# Altium schematic sheet MCU.schdoc
size 308 x 181 mm
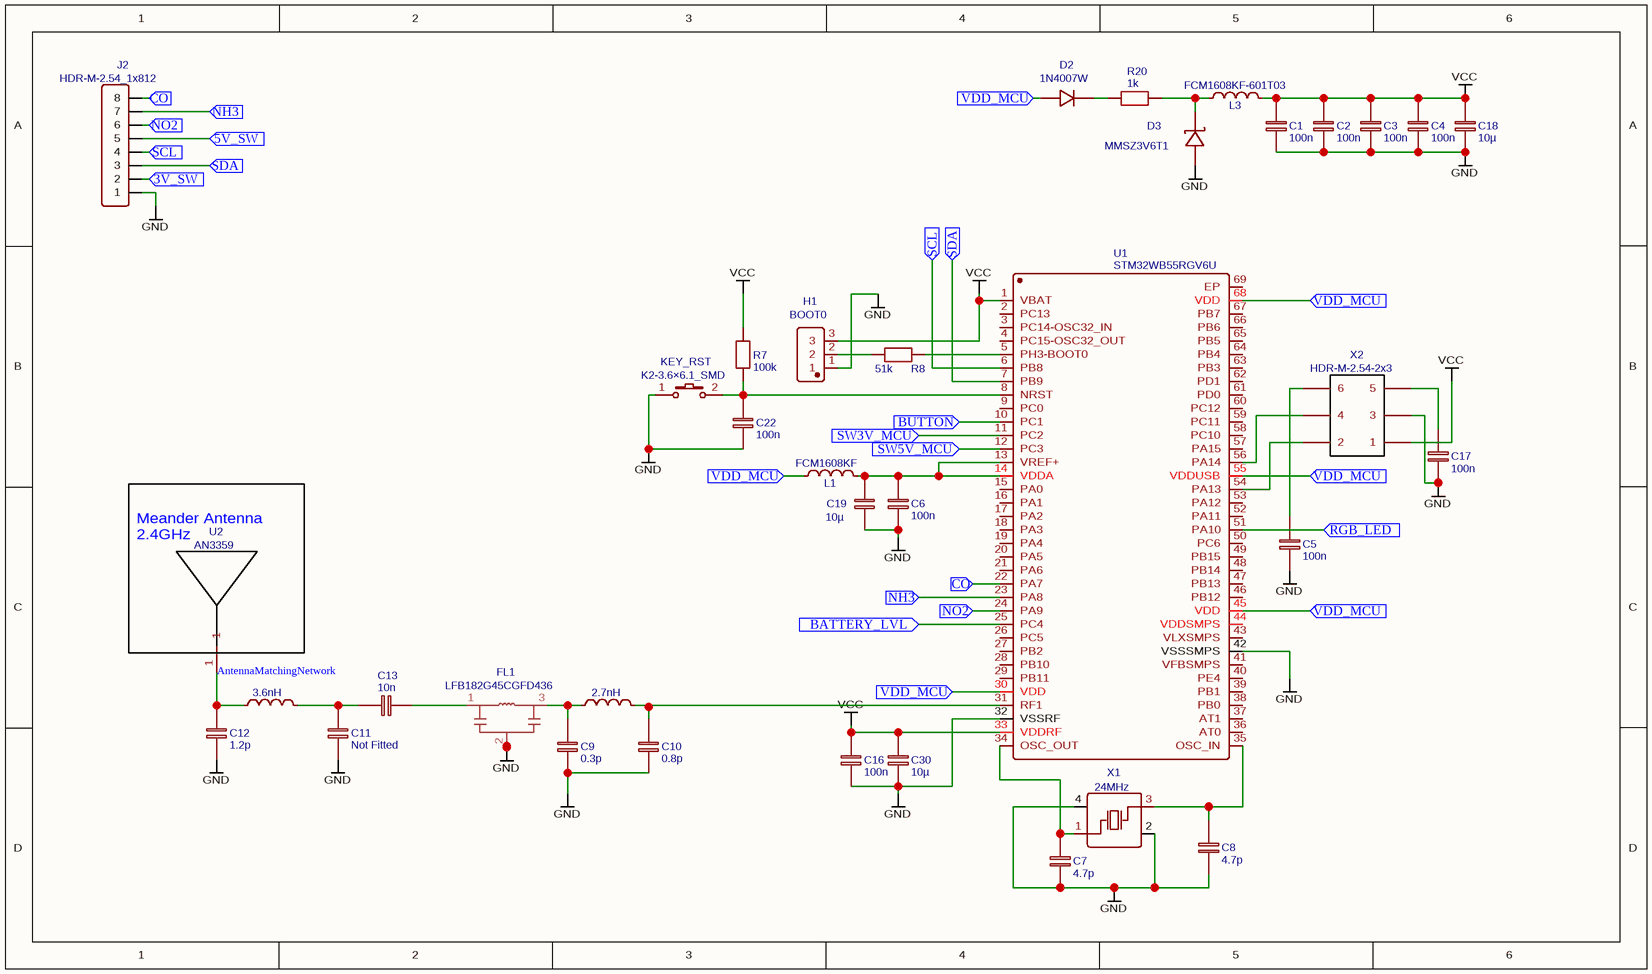
[diagram p0: MCU.schdoc]

## Parts
C1  100n  [C0603]
C2  100n  [C0603]
C3  100n  [C0603]
C4  100n  [C0603]
C5  100n  [C0603]
C6  100n  [C0603]
C7  4.7p  [C0603]
C8  4.7p  [C0603]
C9  0.3p  [C0603]
C10  0.8p  [C0603]
C11  Not Fitted  [C0603]
C12  1.2p  [C0603]
C13  10n  [C0603]
C16  100n  [C0603]
C17  100n  [C0603]
C18  10µ  [C0603]
C19  10µ  [C0603]
C22  100n  [C0603]
C30  10µ  [C0603]
D2  1N4007W  [SOD-123_L2.8-W1.8-LS3.7-RD]
D3  MMSZ3V6T1  [SOD-523_L1.2-W0.8-LS1.6-RD]
FL1  LFB182G45CGFD436  [FIL_LFB182G45CGFD436]
H1  BOOT0  [HDR-TH_03P-P2.54-V-M]
J2  HDR-M-2.54_1x812  [HDR-M-2.54_1X8]
KEY_RST  K2-3.6×6.1_SMD  [KEY-SMD_2P-L6.2-W3.6-LS8.0]
L  3.6nH  [L0402]
L1  FCM1608KF  [L0603]
L3  FCM1608KF-601T03  [L0603]
NO  2.7nH  [L0402]
R7  100k  [R0603]
R8  51k  [R0603]
R20  1k  [R0603]
U1  STM32WB55RGV6U  [VFQFPN-68_L8.0-W8.0-P0.40-TL-EP6.4]
U2  AN3359  [AN3359]
X1  24MHz  [CRYSTAL-SMD_4P-L3.2-W2.5-BL]
X2  HDR-M-2.54-2x3  [HDR-M-2.54-2X3-FP]

## Ports
3V_SW (in), 5V_SW (in), BATTERY_LVL (in), BUTTON (in), CO (in), NH3 (in), NO2 (in), RGB_LED (in), SCL (in), SDA (in), SW3V_MCU (in), SW5V_MCU (in), VDD_MCU (in)

## Nets
GND: C1.1 C2.1 C3.1 C4.1 C5.1 C6.1 C7.1 C8.1 C9.1 C10.1 C11.1 C12.1 C16.1 C17.1 C18.1 C19.1 C22.1 C30.1 D3.2(A) FL1.2(GND) FL1.2_1(GND) H1.1 J2.1 KEY_RST.1 U1.32(VSSRF) U1.42(VSSSMPS) X1.2(GND) X1.4(GND) X2.3
VCC: C1.2 C2.2 C3.2 C4.2 C16.2 C18.2 C30.2 H1.3 L3.2 R7.1 U1.1(VBAT) U1.33(VDDRF) X2.1
3V_SW: J2.2 ; port 3V_SW
5V_SW: J2.5 ; port 5V_SW
AntennaMatchingNetwork: C12.2 L.1 U2.1
BATTERY_LVL: U1.25(PC4) ; port BATTERY_LVL
BUTTON: U1.10(PC1) ; port BUTTON
CO: J2.8 U1.22(PA7) ; port CO
NH3: J2.7 U1.23(PA8) ; port NH3
NO2: J2.6 U1.24(PA9) ; port NO2
RGB_LED: U1.51(PA10) ; port RGB_LED
SCL: J2.4 U1.6(PB8) ; port SCL
SDA: J2.3 U1.7(PB9) ; port SDA
SW3V_MCU: U1.11(PC2) ; port SW3V_MCU
SW5V_MCU: U1.12(PC3) ; port SW5V_MCU
VDD_MCU: D2.2 L1.1 U1.30(VDD) U1.45(VDD) U1.55(VDDUSB) U1.68(VDD) ; port VDD_MCU
NetC5_2: C5.2 X2.6
NetC6_2: C6.2 C19.2 L1.2 U1.13(VREF+) U1.14(VDDA)
NetC7_2: C7.2 U1.34(OSC_OUT) X1.1(OSC1)
NetC8_2: C8.2 U1.35(OSC_IN) X1.3(OSC2)
NetC9_2: C9.2 FL1.3(OUT) NO.1
NetC10_2: C10.2 NO.2 U1.31(RF1)
NetC11_2: C11.2 C13.2 L.2
NetC13_1: C13.1 FL1.1(IN)
NetC17_2: C17.2 X2.5
NetC22_2: C22.2 KEY_RST.2 R7.2 U1.8(NRST)
NetD2_1: D2.1 R20.1
NetD3_1: D3.1(K) L3.1 R20.2
NetH1_2: H1.2 R8.1
NetR8_2: R8.2 U1.5(PH3-BOOT0)
NetU1_54: U1.54(PA13) X2.2
NetU1_56: U1.56(PA14) X2.4

Not connected (* = marked no-connect by the designer): U1 2(PC13) 3(PC14-OSC32_IN) 4(PC15-OSC32_OUT) 9(PC0) 15(PA0) 16(PA1) 17(PA2) 18(PA3) 19(PA4) 20(PA5) 21(PA6) 26(PC5) 27(PB2) 28(PB10) 29(PB11) 36(AT0) 37(AT1) 38(PB0) 39(PB1) 40(PE4) 41(VFBSMPS) 43(VLXSMPS) 44(VDDSMPS) 46(PB12) 47(PB13) 48(PB14) 49(PB15) 50(PC6) 52(PA11) 53(PA12) 57(PA15) 58(PC10) 59(PC11) 60(PC12) 61(PD0) 62(PD1) 63(PB3) 64(PB4) 65(PB5) 66(PB6) 67(PB7) 69(EP)

## Notes on the sheet
- (near U2) Meander Antenna
  2.4GHz

## Library data of the parts
C1-C6 C16 C17 C22 = 100n: nameAlias: Value(F); Contributor: LCEDA_Lib; spicePre: C; spiceSymbolName: C_0603_EU
C7 C8 = 4.7p: nameAlias: Value(F); Contributor: LCEDA_Lib; spicePre: C; spiceSymbolName: C_0603_EU
C9 = 0.3p: nameAlias: Value(F); Contributor: LCEDA_Lib; spicePre: C; spiceSymbolName: C_0603_EU
C10 = 0.8p: nameAlias: Value(F); Contributor: LCEDA_Lib; spicePre: C; spiceSymbolName: C_0603_EU
C11 = Not Fitted: nameAlias: Value(F); Contributor: LCEDA_Lib; spicePre: C; spiceSymbolName: C_0603_EU
C12 = 1.2p: nameAlias: Value(F); Contributor: LCEDA_Lib; spicePre: C; spiceSymbolName: C_0603_EU
C13 = 10n: nameAlias: Value(F); Contributor: LCEDA_Lib; spicePre: C; spiceSymbolName: C_0603_EU
C18 C19 C30 = 10µ: nameAlias: Value(F); Contributor: LCEDA_Lib; spicePre: C; spiceSymbolName: C_0603_EU
D2 = 1N4007W: BOM_Manufacturer: BLUE ROCKET; Contributor: LCEDA_Lib; BOM_Supplier: LCSC; BOM_Supplier Part: C328592; BOM_Manufacturer Part: 1N4007W; spicePre: D; spiceSymbolName: 1N4007W
D3 = MMSZ3V6T1: BOM_Manufacturer: null; BOM_Manufacturer Part: DIODEZENER3.3V500MWSOD-523; Contributor: lcsc; BOM_Supplier: LCSC; BOM_Supplier Part: C9900023612; BOM_JLCPCB Part Class: Extended Part; spicePre: D; spiceSymbolName: DIODEZENER3.3V500MWSOD-523
FL1 = LFB182G45CGFD436: Contributor: Anderson Macedo; spicePre: F; spiceSymbolName: LFB182G45CGFD436
H1 = BOOT0: BOM_Manufacturer: HCTL(华灿天禄); BOM_Manufacturer Part: PZ254-1-03-Z-8.5; Contributor: LCSC; BOM_Supplier: LCSC; BOM_Supplier Part: C2894926; BOM_JLCPCB Part Class: Extended Part; spicePre: H; spiceSymbolName: PZ254-1-03-Z-8.5
J2 = HDR-M-2.54_1x812: Contributor: Hane_Jared; BOM_Supplier Part: C190820; BOM_Supplier: LCSC; spicePre: J; spiceSymbolName: HDR-M-2.54_1x812
KEY_RST = K2-3.6×6.1_SMD: BOM_Manufacturer Part: K2-1107ST-A4SW-06; Contributor: LCEDA_Lib; 制造商: 韩国韩荣; BOM_Supplier Part: C118141; BOM_Supplier: LCSC; spicePre: K; spiceSymbolName: K2-3.6×6.1_SMD
L = 3.6nH: BOM_Manufacturer: MuRata; BOM_Manufacturer Part: LQG15HS3N6S02D; Contributor: cyrilledecourtois; BOM_Température: -55 +125°C; BOM_Prix: 0.085; BOM_Supplier: Mouser; BOM_Supplier Part: 81-LQG15HS3N6S02D; link: https://www.mouser.fr/ProductDetail/Murata-Electronics/LQG15HS3N6S02D?qs=%2Fha2pyFadujBRa%2Fp5CVwGzDiTwg7pAvUcar2Z1OiPA%2FfvOHatjByeQ%3D%3D; BOM_Valeur: 3.6nH; spicePre: L; spiceSymbolName: LQG15HS3N6S02D
L1 = FCM1608KF: BOM_Manufacturer: TAITEC; BOM_Manufacturer Part: FCM1608KF-601T03; Contributor: LCSC; BOM_Supplier: LCSC; BOM_Supplier Part: C141723; BOM_JLCPCB Part Class: Extended Part; spicePre: L; spiceSymbolName: FCM1608KF-601T03
L3 = FCM1608KF-601T03: BOM_Manufacturer: TAITEC; Contributor: LCSC; BOM_Supplier: LCSC; BOM_Supplier Part: C141723; BOM_Manufacturer Part: FCM1608KF-601T03; BOM_JLCPCB Part Class: Extended Part; spicePre: L; spiceSymbolName: FCM1608KF-601T03
NO = 2.7nH: BOM_Manufacturer: MuRata; BOM_Manufacturer Part: LQG15HS2N7S02D; Contributor: cyrilledecourtois; BOM_Température: -55 +125°C; BOM_Prix: 0.085; BOM_Supplier: Mouser; BOM_Supplier Part: 81-LQG15HS2N7S02D; link: https://www.mouser.fr/ProductDetail/Murata-Electronics/LQG15HS2N7S02D?qs=%2Fha2pyFadujt2OiWqNJoxRoxw7kBv0%252ByrT6n939VFw4zHSInabTFCw%3D%3D; BOM_Valeur: 2.7nH; spicePre: L; spiceSymbolName: LQG15HS2N7S02D
R7 = 100k: nameAlias: Value(Ω); Contributor: LCEDA_Lib; spicePre: R; spiceSymbolName: R_0603_EU
R8 = 51k: nameAlias: Value(Ω); Contributor: LCEDA_Lib; spicePre: R; spiceSymbolName: R_0603_EU
R20 = 1k: nameAlias: Value(Ω); Contributor: LCEDA_Lib; spicePre: R; spiceSymbolName: R_0603_EU
U1 = STM32WB55RGV6U: BOM_Manufacturer: ST(意法半导体); Contributor: LCSC; BOM_Supplier: LCSC; BOM_Supplier Part: C1558433; BOM_Manufacturer Part: STM32WB55RGV6U; Frequency: -; spicePre: U; spiceSymbolName: STM32WB55RGV6U
U2 = AN3359: Contributor: ktw07182; BOM_Manufacturer Part: N/A; BOM_Supplier Part: N/A; spicePre: U; spiceSymbolName: AN3359
X1 = 24MHz: BOM_Manufacturer: ABRACON; BOM_Manufacturer Part: ABM8AIG-24.000MHZ-R40-4-T; Contributor: LCSC; nameAlias: Frequency; BOM_Supplier: LCSC; BOM_Supplier Part: C1986620; BOM_JLCPCB Part Class: Extended Part; spicePre: X; spiceSymbolName: ABM8AIG-24.000MHZ-R40-4-T
X2 = HDR-M-2.54-2x3: Contributor: dalex806; spicePre: X; spiceSymbolName: HDR-M-2.54-2x3